# Altium schematic sheet CANConnectors.SCHDOC: CAN Connectors and Fuses
size A4; Organization: UNSW Solar Racing Team; Address3: UNSW; Address4: Sydney NSW 2052; SheetNumber: 4; SheetTotal: 4; Address2: Electrical Engineering; Address1: Rm 109
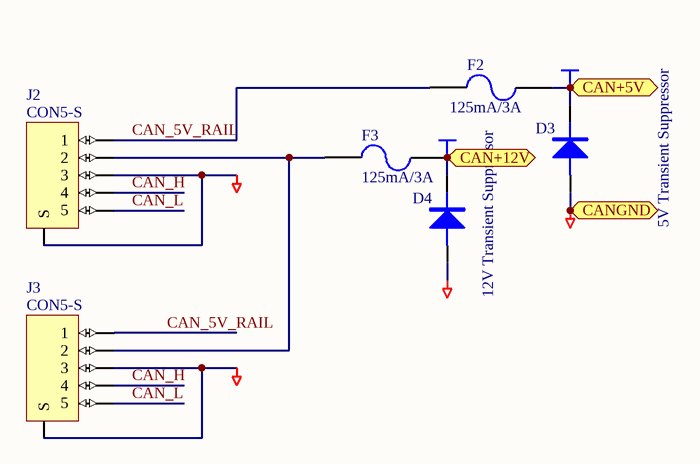
[diagram p0: CANConnectors.SCHDOC]

## Parts
D3  5V Transient Suppressor  [SMA]
D4  12V Transient Suppressor  [SMA]
F2  125mA/3A  [LITTELFUSE-154]
F3  125mA/3A  [LITTELFUSE-154]
J2  CON5-S  [TRIAD5F]
J3  CON5-S  [TRIAD5F]

## Ports
CAN+5V (bidir), CAN+12V (bidir), CANGND (bidir)

## Nets
CAN+5V: D3.K F2.2 ; port CAN+5V
CAN+12V: D4.K F3.2 ; port CAN+12V
CANGND: D3.A D4.A J2.0(S) J2.3 J3.0(S) J3.3 ; port CANGND
CAN_5V_RAIL: F2.1 J2.1 J3.1
CAN_H: J2.4 J3.4
CAN_L: J2.5 J3.5
NetF3_1: F3.1 J2.2 J3.2

## Notes on the sheet
- Title
- Size:
- Date:
- A4
- Number:
- Time:
- Revision:
- Sheet
- of
- File:

## Library data of the parts
D3 D4 = DIODE: Price: 1.25
  D3: Farnell: 302-2973
  D4: Farnell: 302-3096
F2 F3 = FUSE2: Fuse; Farnell: 154-375T (Holder + 125mA fuse) AND 0454 003 (3A Fuse); Price: 4.00
J2 J3 = CON5-S: Connector, 2 pin, with shield @ S; Farnell: 131-040; Price: 16.79